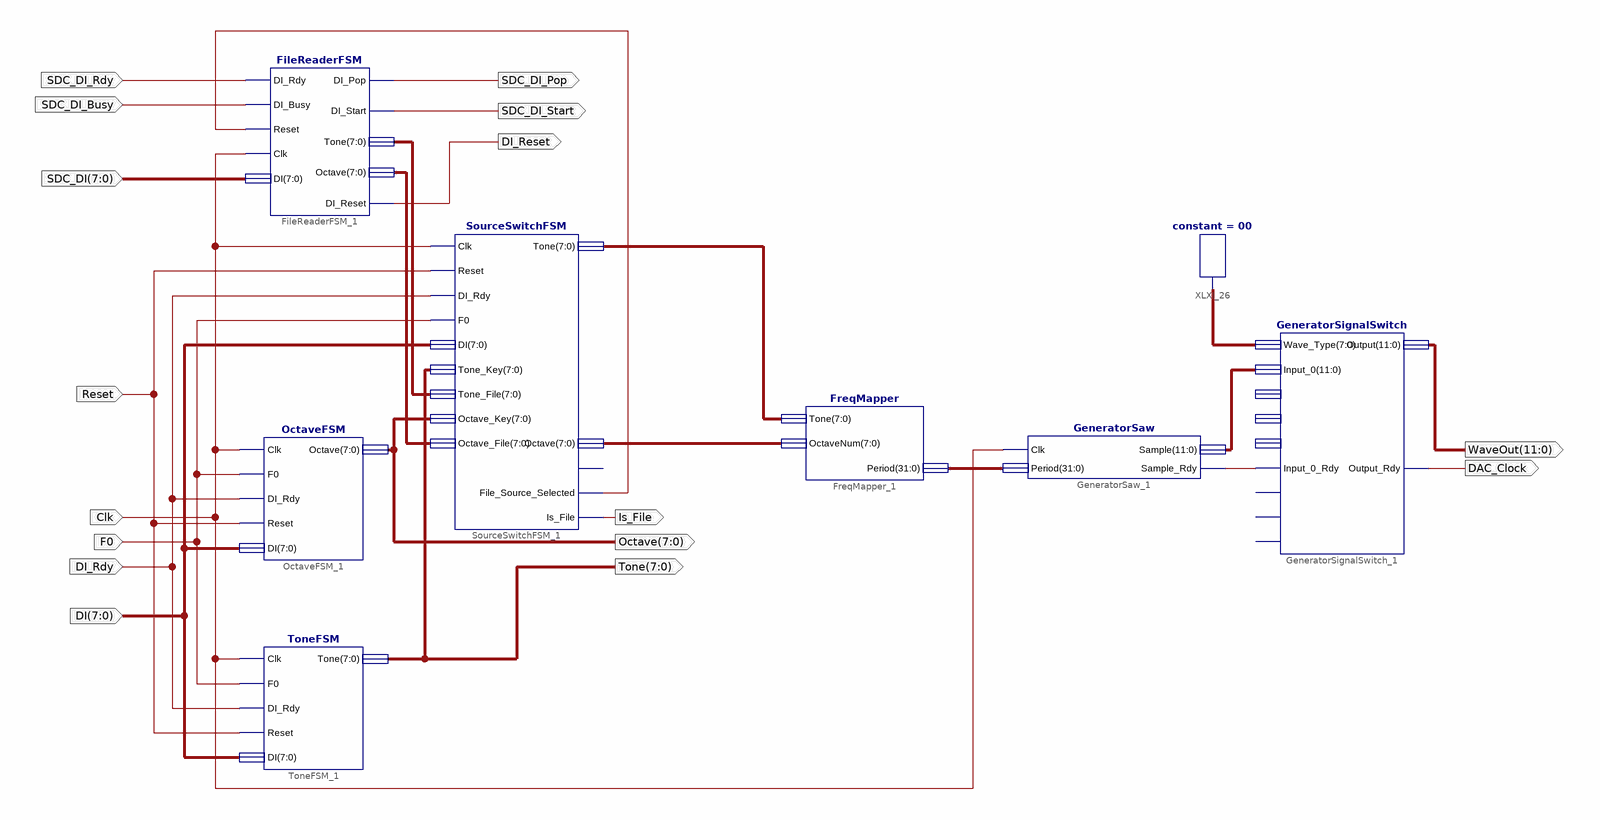
[diagram p0: schematic sheet 1]
// Xilinx ISE schematic InnerLogic.sch (spartan3e) as structural Verilog: 8 symbols, 16 ports
module InnerLogic (
  input  SDC_DI_Busy,
  input  [7:0] SDC_DI,
  input  SDC_DI_Rdy,
  input  [7:0] DI,
  input  F0,
  input  DI_Rdy,
  input  Reset,
  input  Clk,
  output SDC_DI_Pop,
  output SDC_DI_Start,
  output DI_Reset,
  output [7:0] Octave,
  output [7:0] Tone,
  output [11:0] WaveOut,
  output DAC_Clock,
  output Is_File
);

  wire XLXN_266, XLXN_382;
  wire [7:0] XLXN_157, XLXN_224, XLXN_247, XLXN_371, XLXN_373;
  wire [11:0] XLXN_265;
  wire [31:0] XLXN_232;

  FileReaderFSM FileReaderFSM_1 (
    .DI_Rdy(SDC_DI_Rdy), .DI_Busy(SDC_DI_Busy), .Reset(XLXN_382), .Clk(Clk), .DI(SDC_DI),
    .DI_Pop(SDC_DI_Pop), .DI_Reset(DI_Reset), .DI_Start(SDC_DI_Start), .Tone(XLXN_157), .Octave(XLXN_224));
  SourceSwitchFSM SourceSwitchFSM_1 (
    .Clk(Clk), .Reset(Reset), .DI_Rdy(DI_Rdy), .F0(F0), .DI(DI), .Tone_Key(Tone), .Tone_File(XLXN_157),
    .Octave_Key(Octave), .Octave_File(XLXN_224), .File_Source_Selected(XLXN_382), .Tone(XLXN_371),
    .Octave(XLXN_373), .Is_File(Is_File));  // open: Key_Source_Selected
  ToneFSM ToneFSM_1 (.Clk(Clk), .F0(F0), .DI_Rdy(DI_Rdy), .Reset(Reset), .DI(DI), .Tone(Tone));
  FreqMapper FreqMapper_1 (.Tone(XLXN_371), .OctaveNum(XLXN_373), .Period(XLXN_232));
  GeneratorSaw GeneratorSaw_1 (.Clk(Clk), .Period(XLXN_232), .Sample_Rdy(XLXN_266), .Sample(XLXN_265));
  GeneratorSignalSwitch GeneratorSignalSwitch_1 (
    .Input_0_Rdy(XLXN_266), .Wave_Type(XLXN_247), .Input_0(XLXN_265), .Output_Rdy(DAC_Clock), .Output(WaveOut));  // open: Input_1_Rdy, Input_2_Rdy, Input_3_Rdy, Input_1, Input_2, Input_3
  constant #(.CValue("00")) XLXI_26 (.O(XLXN_247));
  OctaveFSM OctaveFSM_1 (.Clk(Clk), .F0(F0), .DI_Rdy(DI_Rdy), .Reset(Reset), .DI(DI), .Octave(Octave));
endmodule
